# EAGLE design PPM2DSM_fix (EAGLE 6.6.0)
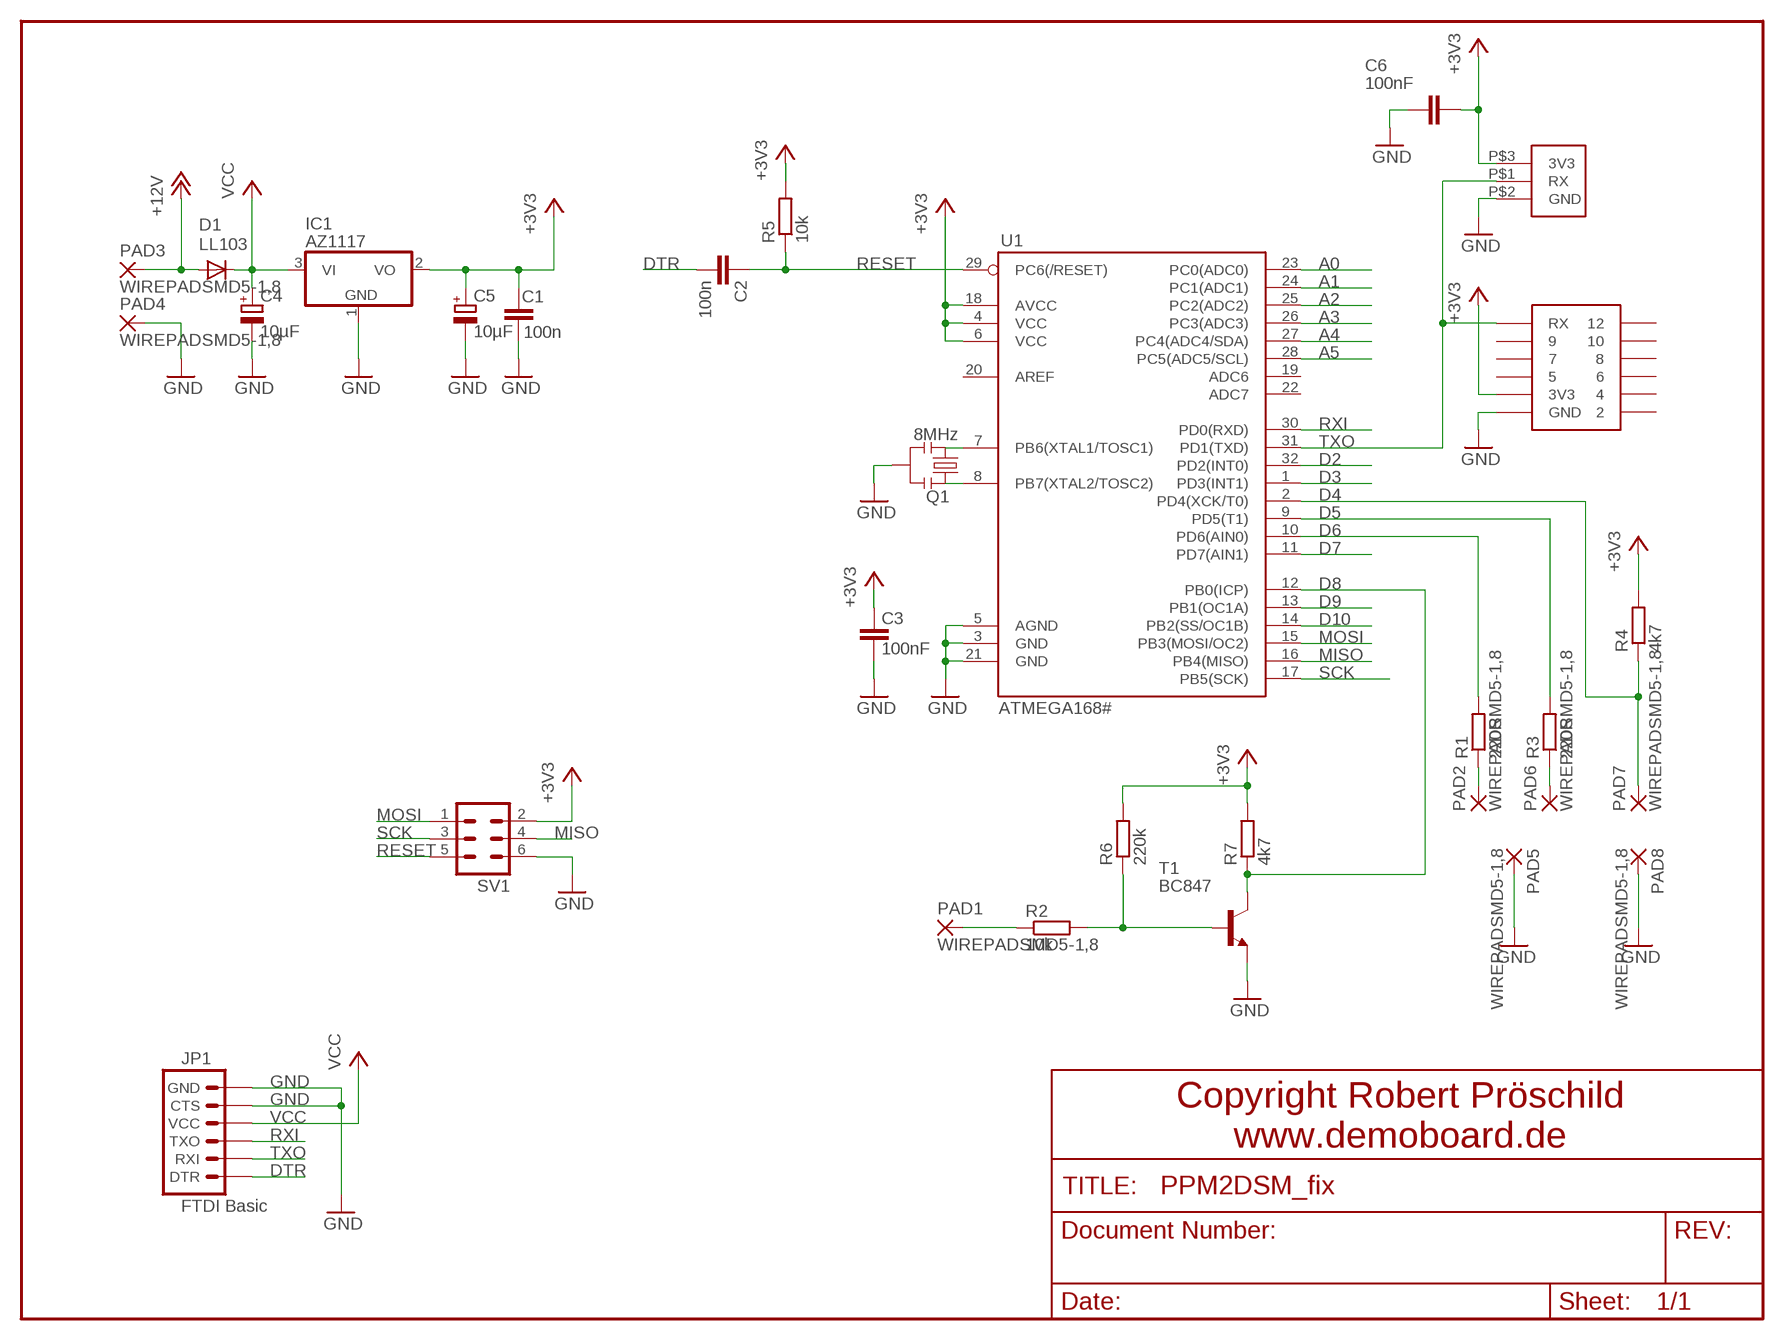
[diagram p0: schematic, sheet 1]

## Parts
C1  100n  C-EUC0805  [C0805]
C2  100n  C-EUC0805  [C0805]
C3  100nF  C-EUC0805  [C0805]
C4  10µF  CPOL-EUCT6032  [CT6032]
C5  10µF  CPOL-EUCT6032  [CT6032]
C6  100nF  C-EUC0805  [C0805]
D1  LL103  DIODE-MINIMELF  [MINIMELF]
IC1  AZ1117  [SOT223]
IC2  X10EMTX  [X10EMTX]
IC3  X1TX0  [X1TX0]
JP1  FTDI Basic  ARDUINO_SERIAL_PROGRAMPTH  [1X06]
PAD1  WIREPADSMD5-1,8  [5-1,8]
PAD2  WIREPADSMD5-1,8  [5-1,8]
PAD3  WIREPADSMD5-1,8  [5-1,8]
PAD4  WIREPADSMD5-1,8  [5-1,8]
PAD5  WIREPADSMD5-1,8  [5-1,8]
PAD6  WIREPADSMD5-1,8  [5-1,8]
PAD7  WIREPADSMD5-1,8  [5-1,8]
PAD8  WIREPADSMD5-1,8  [5-1,8]
Q1  8MHz  RESONATORSMD  [RESONATOR-SMD]
R1  220R  R-EU_R0805  [R0805]
R2  10k  R-EU_R0805  [R0805]
R3  220R  R-EU_R0805  [R0805]
R4  4k7  R-EU_R0805  [R0805]
R5  10k  R-EU_R0805  [R0805]
R6  220k  R-EU_R0805  [R0805]
R7  4k7  R-EU_R0805  [R0805]
SV1  MA03-2  [MA03-2]
T1  BC847  [SOT23]
U1  ATMEGA168#  ATMEGA168  [TQFP32-08]

## Nets
+3V3: C1.2 C3.2 C5.+ C6.2 IC1.2(VO) IC2.P$3(3V3) IC3.3(3V3) R4.2 R5.2 R6.2 R7.2 SV1.2 U1.4(VCC) U1.6(VCC) U1.18(AVCC)
+12V: D1.A PAD3.1(P)
A0: U1.23(PC0(ADC0))
A1: U1.24(PC1(ADC1))
A2: U1.25(PC2(ADC2))
A3: U1.26(PC3(ADC3))
A4: U1.27(PC4(ADC4/SDA))
A5: U1.28(PC5(ADC5/SCL))
D2: U1.32(PD2(INT0))
D3: U1.1(PD3(INT1))
D4: PAD7.1(P) R4.1 U1.2(PD4(XCK/T0))
D5: R3.2 U1.9(PD5(T1))
D6: R1.2 U1.10(PD6(AIN0))
D7: U1.11(PD7(AIN1))
D8: R7.1 T1.3(C) U1.12(PB0(ICP))
D9: U1.13(PB1(OC1A))
D10: U1.14(PB2(SS/OC1B))
DTR: C2.2 JP1.1(DTR)
GND [vcc]: C1.1 C3.1 C4.- C5.- C6.1 IC1.1(GND) IC2.P$2(GND) IC3.1(GND) JP1.5(CTS) JP1.6(GND) PAD4.1(P) PAD5.1(P) PAD8.1(P) Q1.2 SV1.6 T1.2(E) U1.3(GND) U1.5(AGND) U1.21(GND)
MISO: SV1.4 U1.16(PB4(MISO))
MOSI: SV1.1 U1.15(PB3(MOSI/OC2))
N$1: Q1.1 U1.8(PB7(XTAL2/TOSC2))
N$2: Q1.3 U1.7(PB6(XTAL1/TOSC1))
N$5: R2.2 R6.1 T1.1(B)
N$6: PAD1.1(P) R2.1
N$7: PAD2.1(P) R1.1
N$38: PAD6.1(P) R3.1
RESET: C2.1 R5.1 SV1.5 U1.29(PC6(/RESET))
RXI: JP1.3(TXO) U1.30(PD0(RXD))
SCK: SV1.3 U1.17(PB5(SCK))
TXO: IC2.P$1(RX) IC3.11(RX) JP1.2(RXI) U1.31(PD1(TXD))
VCC: C4.+ D1.C IC1.3(VI) JP1.4(VCC)
Unconnected: IC3.5 IC3.6 IC3.7 IC3.8 IC3.9 IC3.10 IC3.12 U1.19(ADC6) U1.20(AREF) U1.22(ADC7)

## Notes on the sheet
- Copyright Robert Pröschild
  www.demoboard.de

## Power pins joined to a net without a drawn wire
2: IC3.2
4: IC3.4

## Library data of the parts
C1-C3 C6 = rcl:C-EU: CAPACITOR, European symbol
C4 C5 = rcl:CPOL-EU: POLARIZED CAPACITOR, European symbol
D1 = diode:DIODE-: DIODE
IC1 = linear:AZ1117
IC2 = Spektrum:X10EMTX
IC3 = Spektrum:X1TX0
JP1 = SparkFun:ARDUINO_SERIAL_PROGRAM
PAD1-PAD8 = wirepad:WIREPAD: Wire PAD connect wire on PCB
Q1 = SparkFun:RESONATOR: Resonator Small SMD resonator. This is the itty bitty 10/20MHz resonators with built in caps. CSTCE10M0G55 and CSTCE20M0V53. Footprint has been reviewed closely but hasn't been tested yet.
R1-R7 = rcl:R-EU_: RESISTOR, European symbol
SV1 = con-lstb:MA03-2: PIN HEADER; OC_FARNELL: unknown; OC_NEWARK: unknown
T1 = transistor:BC847: NPN TRANSISTOR
U1 = SparkFun:ATMEGA168

## Net classes
0 default: width 0.203 mm
1 vcc: width 0.254 mm

## Board
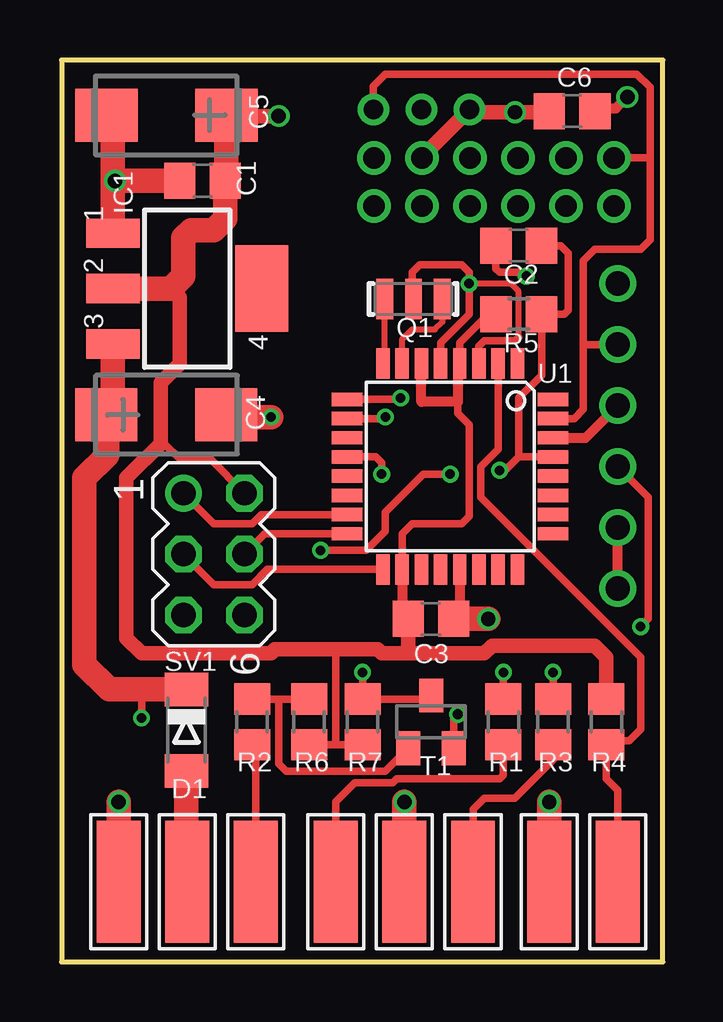
[diagram p1: board, top side]
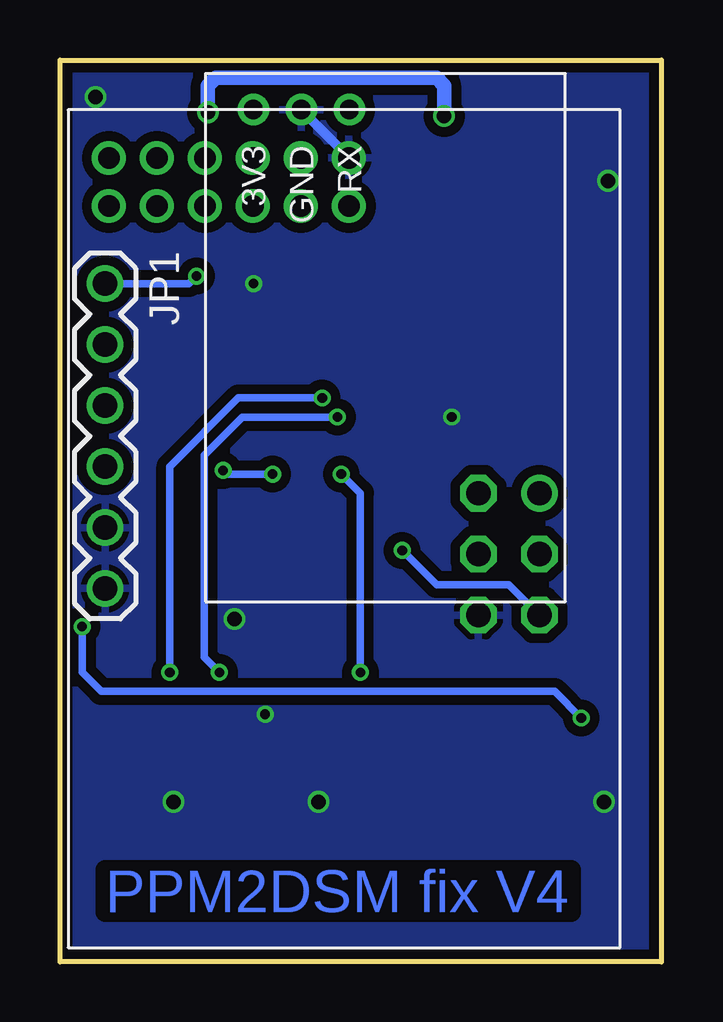
[diagram p2: board, bottom side, seen from below]

Size 25.05 x 37.58 mm. Coordinates in mm from the lower left corner, seen from the top.
Outline: 0,37.58 0,0 25.05,0 25.05,37.58 0,37.58
Copper layers (1*16): Top 0.035mm / dielectric 1.5mm / Bottom 0.035mm
Design rules "M&V *": minimum track width 0.15mm, minimum drill 0.3mm, track to track 0.15mm, track to pad 0.15mm, pad to pad 0.15mm, via to via 0.15mm, smd to smd 0.15mm, copper to edge 4mil, drill to drill 8mil, minimum pad ring 10mil, minimum via ring 6mil, stop-mask expansion 4mil, vias tented up to drill 20mil, thermal gap 10mil

### Footprints (pad centres in the part's own frame; a part is rotated, then mirrored left to right if it is on the bottom)
C0805 = smd 1.3 x 1.5: 1 -0.95,0; 2 0.95,0
CT6032 = smd 2.6 x 2.2: + -2.5,0; - 2.5,0
MINIMELF = smd 1.4 x 1.8: A 1.7,0; C -1.7,0
SOT223 = smd 1.219 x 2.235: 1 -2.311,-3.099; 2 0,-3.099; 3 2.311,-3.099 | smd 3.6 x 2.2: 4 0,3.099
X10EMTX = drill 0.8: P$1 0,0; P$2 2,0; P$3 4,0
X1TX0 = drill 0.9: 1 0,0; 2 0,2; 3 2,0; 4 2,2; 5 4,0; 6 4,2; 7 6,0; 8 6,2; 9 8,0; 10 8,2; 11 10,0; 12 10,2
1X06 = drill 1.016: 1 0,0; 2 2.54,0; 3 5.08,0; 4 7.62,0; 5 10.16,0; 6 12.7,0
5-1,8 = smd 1.829 x 5.08: 1 0,0
RESONATOR-SMD = smd 0.7 x 1.7: 1 -1.2,0; 2 0,0; 3 1.2,0
R0805 = smd 1.3 x 1.5: 1 -0.95,0; 2 0.95,0
MA03-2 = drill 1.016: 1 -2.54,-1.27 | drill 1.016 octagon: 2 -2.54,1.27; 3 0,-1.27; 4 0,1.27; 5 2.54,-1.27; 6 2.54,1.27
SOT23 = smd 1 x 1.4: 1 -0.95,-1.1; 2 0.95,-1.1; 3 0,1.1
TQFP32-08 = smd 1.27 x 0.559: 1 -4.293,2.8; 2 -4.293,2; 3 -4.293,1.2; 4 -4.293,0.4; 5 -4.293,-0.4; 6 -4.293,-1.2; 7 -4.293,-2; 8 -4.293,-2.8; 17 4.293,-2.8; 18 4.293,-2; 19 4.293,-1.2; 20 4.293,-0.4; 21 4.293,0.4; 22 4.293,1.2; 23 4.293,2; 24 4.293,2.8 | smd 0.559 x 1.27: 9 -2.8,-4.293; 10 -2,-4.293; 11 -1.2,-4.293; 12 -0.4,-4.293; 13 0.4,-4.293; 14 1.2,-4.293; 15 2,-4.293; 16 2.8,-4.293; 25 2.8,4.293; 26 2,4.293; 27 1.2,4.293; 28 0.4,4.293; 29 -0.4,4.293; 30 -1.2,4.293; 31 -2,4.293; 32 -2.8,4.293

### Placement (x,y rotation side)
C1  5.87,32.54 0 top
C2  19.05,29.84 180 top
C3  15.4,14.29 180 top
C4  4.37,22.8 0 top
C5  4.37,35.28 180 top
C6  21.28,35.45 180 top
D1  5.21,9.65 270 top
IC1  5.24,28.05 270 top
IC2  13,35.51 180 bottom
IC3  13.02,33.5 180 bottom
JP1  23.18,28.26 270 bottom
PAD1  8.1,3.33 0 top
PAD2  11.43,3.33 180 top
PAD3  5.24,3.33 0 top
PAD4  2.38,3.33 0 top
PAD5  14.29,3.33 180 top
PAD6  17.14,3.33 180 top
PAD7  23.18,3.33 0 top
PAD8  20.32,3.33 180 top
Q1  14.67,27.62 0 top
R1  18.41,10 90 top
R2  7.94,10 90 top
R3  20.48,10 90 top
R4  22.7,10 90 top
R5  19.05,26.99 180 top
R6  10.32,10 270 top
R7  12.54,10 270 top
SV1  6.35,16.99 270 top
T1  15.4,10 0 top
U1  16.19,20.64 270 top

### Tracks (layer width: path | path; a pad name or v marks a point on that pad's centre or on a via)
+3V3  (via drill 0.6)
  Top 0.254: U1.4 16.59,25.48
  Top 0.305: R6.2 11.42,9.05 | 11.42,9.05 R7.2 | 16.59,25.48 16.59,25.8 17.94,27.15 R5.2 | 11.42,9.05 11.42,13 11.43,13.02 | SV1.2 6.19,20.95 4.92,20.95 4.29,21.59 4.13,21.59 | U1.18 14.19,17.84 14.61,18.26 16.67,18.26 16.99,18.57 16.99,22.38 16.51,22.86 16.51,23.34
  Top 0.406: U1.18 14.19,14.29 C3.2 14.29,14.29 | U1.4 16.51,24.85 16.51,23.34 14.99,23.34 U1.6 | C6.2 20.28,35.4 | 6.9,35.24 C5.+
  Top 0.61: 20.28,35.4 v18.89,35.4 17.11,35.4 IC2.P$3 15.02,33.53 IC3.3 | v9.05,35.24 6.9,35.24 | R4.2 22.7,12.7 22.23,13.18 17.94,13.18 17.62,12.86 14.29,12.86 | C3.2 14.45,13.02 14.29,12.86 | 14.29,12.86 13.34,12.86 13.18,13.02 11.43,13.02 8.89,13.02 8.73,12.86 3.33,12.86 2.7,13.49 2.7,20.16 4.13,21.59 4.13,24.13 4.92,24.92 4.92,27.69 4.56,28.05
  Top 1.016: C5.+ 6.87,32.59 C1.2 6.82,30.95 6.35,30.48 5.4,30.48 5.08,30.16 5.08,28.57 4.56,28.05 IC1.2
  Bottom 0.61: v18.89,35.4 18.89,36.51 18.57,36.83 9.37,36.83 9.05,36.51 v9.05,35.24
+12V
  Top 1.016: PAD3.1 5.22,3.35 D1.A
D4
  Top 0.305: PAD7.1 23.18,7.14 22.7,7.62 R4.1 | 22.55,9.21 R4.1 | R4.1 22.86,9.21 23.65,9.21 24.13,9.68 24.13,12.7 17.46,19.37 17.46,20.64 18.19,21.37 U1.2
D5  (via drill 0.4)
  Top 0.305: R3.2 v20.48,12.06 | v14.13,23.5 14.07,23.44 U1.9
  Bottom 0.305: v20.48,12.06 20.48,20.64 17.62,23.5 v14.13,23.5
D6  (via drill 0.4)
  Top 0.305: R1.2 v18.41,12.06 | v13.49,22.7 13.43,22.64 U1.10
  Bottom 0.305: v18.41,12.06 19.05,12.7 19.05,21.11 17.46,22.7 v13.49,22.7
D8  (via drill 0.4)
  Top 0.305: T1.3 15.25,10.95 R7.1 v12.54,12.06 | U1.12 13.09,21.04 13.34,20.8 v13.34,20.32
  Bottom 0.305: v12.54,12.06 12.54,19.53 v13.34,20.32
DTR  (via drill 0.4)
  Top 0.305: C2.2 18.1,28.89 18.26,28.73 19.21,28.73 v19.37,28.57
  Bottom 0.305: v19.37,28.57 19.68,28.26 JP1.1
GND  (via drill 0.4, 0.6)
  Top 0.254: 14.61,27.69 Q1.2 | 19.05,26.04 19.05,27.94 18.73,28.26 v16.99,28.26
  Top 0.305: 2.14,32.51 2.19,32.51 v2.22,32.54 | T1.2 16.35,10.16 v16.51,10.32 | 14.61,27.69 14.61,28.73 14.92,29.05 16.67,29.05 16.99,28.73 v16.99,28.26 16.99,26.99 15.79,25.79 U1.5 | U1.3 17.39,25.65 17.62,25.88 18.89,25.88 19.05,26.04
  Top 0.406: U1.21 16.59,14.29 C3.1 | JP1.6 JP1.5 | C6.1 22.34,35.56 23.1,35.56 v23.57,36.04
  Top 1.016: 16.59,14.29 v17.78,14.29 | PAD4.1 v2.38,6.67 | PAD5.1 v14.29,6.67 | PAD8.1 v20.32,6.67 | IC1.1 2.14,32.51 2.14,32.7 | 2.14,32.7 2.14,35 C5.- | C1.1 2.3,32.54 2.14,32.7 | C4.- 6.77,22.7 v8.73,22.7
  Bottom 0.406: IC2.P$2 13.02,33.53 IC3.1
  pour Bottom (isolate 0.406): 0.32,0.32 24.77,0.32 24.77,37.31 0.32,37.31
MISO
  Top 0.305: SV1.4 8.47,17.84 U1.16
MOSI
  Top 0.305: SV1.1 6.35,18.26 7.94,18.26 8.32,18.64 U1.15
N$1
  Top 0.254: U1.8 13.47,25.01 Q1.1
N$2
  Top 0.254: U1.7 14.19,25.94 14.61,26.35 15.56,26.35 15.88,26.67 Q1.3
N$5
  Top 0.305: R2.2 9.05,10.95 | 9.05,10.95 R6.1 | T1.1 13.48,7.94 9.37,7.94 9.05,8.26 9.05,10.95
N$6
  Top 0.305: PAD1.1 8.1,8.57 R2.1
N$7
  Top 0.305: PAD2.1 11.43,6.67 12.22,7.46 13.81,7.46 13.97,7.62 18.26,7.62 18.41,7.78 R1.1
N$38
  Top 0.305: PAD6.1 17.14,6.35 17.62,6.83 18.89,6.83 20.48,8.41 R3.1
RESET  (via drill 0.4)
  Top 0.305: 19.05,21.04 19.05,23.5 20,24.45 R5.1 20.95,26.99 21.11,27.15 21.11,29.53 20.8,29.84 C2.1 | v10.79,17.14 12.7,17.14 13.49,17.94 13.49,18.73 15.08,20.32 v16.19,20.32 | 19.05,21.04 U1.29 | v18.26,20.48 18.49,20.48 19.05,21.04
  Bottom 0.305: SV1.5 6.35,15.72 9.37,15.72 v10.79,17.14 | v16.19,20.32 18.1,20.32 v18.26,20.48
RXI
  Top 0.406: U1.30 21.84,21.84 JP1.3
SCK
  Top 0.305: SV1.3 6.35,15.72 7.94,15.72 8.57,16.35 U1.17
TXO
  Top 0.305: U1.31 21.37,22.64 21.75,23.02 21.75,25.72 | 21.75,25.72 JP1.2 | 21.75,25.72 21.75,29.21 22.23,29.69 24.13,29.69 24.53,30.08 24.53,33.5 | IC2.P$1 13,36.49 13.49,36.99 23.97,36.99 24.53,36.43 24.53,33.5 | IC3.11 24.53,33.5
VCC  (via drill 0.4)
  Top 0.305: JP1.4 24.45,19.37 24.45,14.29 v24.13,13.97 | v3.33,10.16 3.33,11.2 3.49,11.35
  Top 1.016: 1.82,22.75 C4.+ | IC1.3 2.14,23.07 C4.+ | D1.C 3.49,11.35 1.98,11.35 0.95,12.38 0.95,20.16 1.91,21.11 1.91,22.75 C4.+
  Bottom 0.305: v24.13,13.97 24.13,12.06 23.34,11.27 4.45,11.27 v3.33,10.16

### Text on the board
Bottom: PPM2DSM fix V4
tValues: Tent Vias! | Arduino Wee v1.3
Document: Copyright by / Robert Pröschild / proeschild@gmx.de / www.demoboard.de / only for private use